# EAGLE design v2.1 USB_UART (EAGLE 9.7.0)
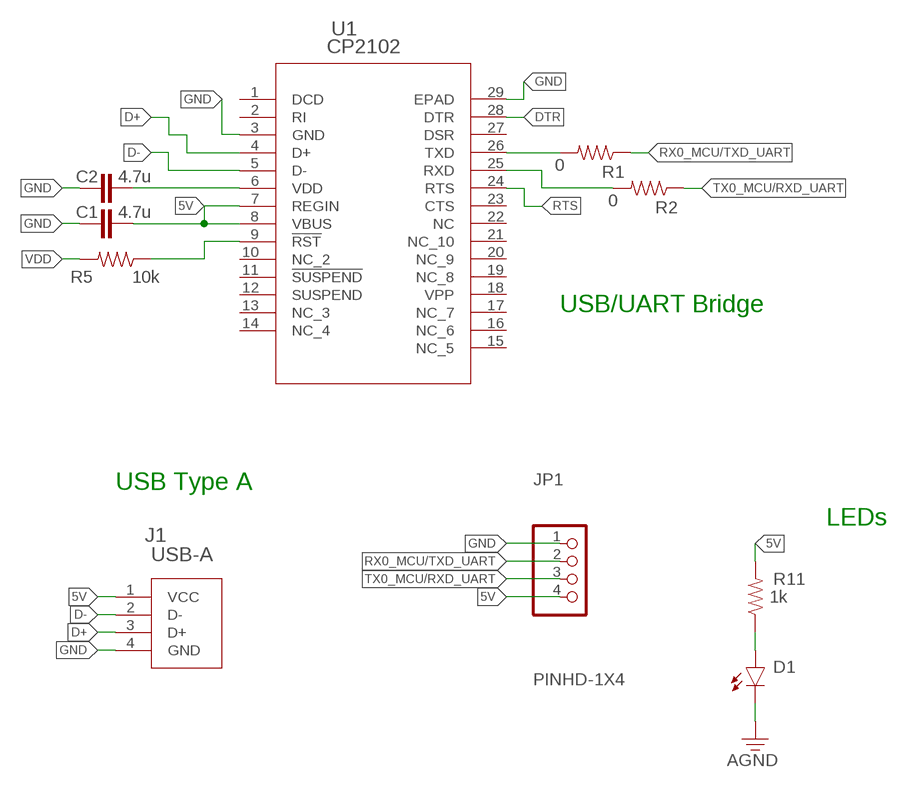
[diagram p0: schematic, sheet 1]

## Parts
C1  4.7u  C_CHIP-0805(2012-METRIC)  [CAPC2012X110]
C2  4.7u  C_CHIP-0805(2012-METRIC)  [CAPC2012X110]
D1  LED  CHIP-FLAT-B_0805  [LEDC2012X110N_FLAT-B]
J1  USB-A  USB-A1VSB6_OST  [USB-A]
JP1  PINHD-1X4  [1X04]
R1  0  R-US_CHIP-0805(2012-METRIC)  [RESC2012X65]
R2  0  R-US_CHIP-0805(2012-METRIC)  [RESC2012X65]
R5  10k  R-US_CHIP-0805(2012-METRIC)  [RESC2012X65]
R11  1k  R-US_CHIP-0805(2012-METRIC)  [RESC2012X65]
U1  CP2102  CP2102-GMQFN28_5X5_SIL  [QFN28_5X5_SIL]

## Nets
5V: C1.2 J1.1(VCC) JP1.4 R11.2 U1.7(REGIN) U1.8(VBUS)
D+: J1.3(D+) U1.4(D+)
D-: J1.2(D-) U1.5(D-)
DTR: U1.28(DTR)
GND: C1.1 C2.1 D1.C J1.4(GND) JP1.1 U1.3(GND) U1.29(EPAD) ; supply symbol labelled AGND
N$1: D1.A R11.1
N$5: R5.1 U1.9(!RST)
RTS: U1.24(RTS)
RX0_MCU/TXD_UART: JP1.2 R1.1
RXD: R2.2 U1.25(RXD)
TX0_MCU/RXD_UART: JP1.3 R2.1
TXD: R1.2 U1.26(TXD)
VDD: C2.2 R5.2 U1.6(VDD)
Unconnected: U1.1(DCD) U1.2(RI) U1.10(NC_2) U1.11(!SUSPEND) U1.12(SUSPEND) U1.13(NC_3) U1.14(NC_4) U1.15(NC_5) U1.16(NC_6) U1.17(NC_7) U1.18(VPP) U1.19(NC_8) U1.20(NC_9) U1.21(NC_10) U1.22(NC) U1.23(CTS) U1.27(DSR)

## Notes on the sheet
- USB/UART Bridge
- USB Type A
- LEDs

## Library data of the parts
C1 C2 = Capacitor:C: Capacitor - Generic; CATEGORY: Capacitor; PACKAGE_SIZE: 0805; PACKAGE_TYPE: SMD; SUBCATEGORY: Ceramic Capacitors; TYPE: MLCC
D1 = LED:CHIP-FLAT-B: Blue LED - Generic; CATEGORY: LED; COLOR: Blue; DESCRIPTION: Blue LED Indication 0805 (2012 Metric); PACKAGE_SIZE: 0805; PACKAGE_TYPE: SMD; SUBCATEGORY: Chip LED; TYPE: Square with Flat Top
J1 = SD-SolderSync-Library:USB-A; COPYRIGHT: Copyright (C) 2025 Ultra Librarian. All rights reserved.; MANUFACTURER_PART_NUMBER: USB-A1VSB6; MFR_NAME: On Shore Technology
JP1 = Connector:PINHD-1X4: PIN HEADER; CATEGORY: Headers; DESCRIPTION: Header-Straight-4 Position; PACKAGE_TYPE: THT; PITCH: 0.100" (2.54mm); SUBCATEGORY: Headers-Male Pins; TYPE: Board to Board or Cable-Unshrouded-Through Hole-Straight
R1 R2 R5 R11 = Resistor:R-US: Resistor Fixed - ANSI; CATEGORY: Resistors; DESCRIPTION: Chip Resistor 2.00 X 1.25 X 0.65 mm body 0805(2012-METRIC) Package; PACKAGE_SIZE: 0805; PACKAGE_TYPE: SMD
U1 = SD-SolderSync-Library:CP2102-GM; COPYRIGHT: Copyright (C) 2025 Ultra Librarian. All rights reserved.; MANUFACTURER_PART_NUMBER: CP2102-GM; MFR_NAME: Silicon Labs

## Board
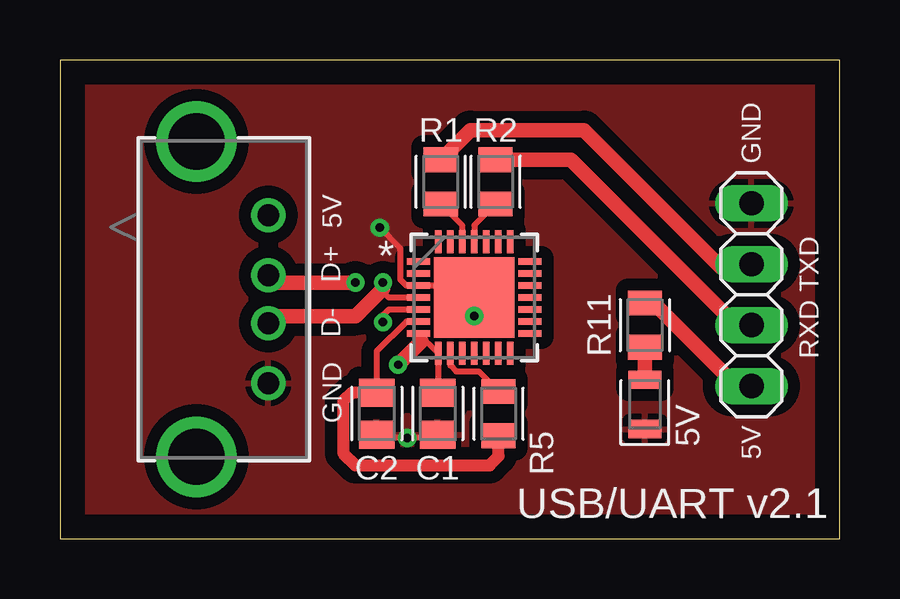
[diagram p1: board, top side]
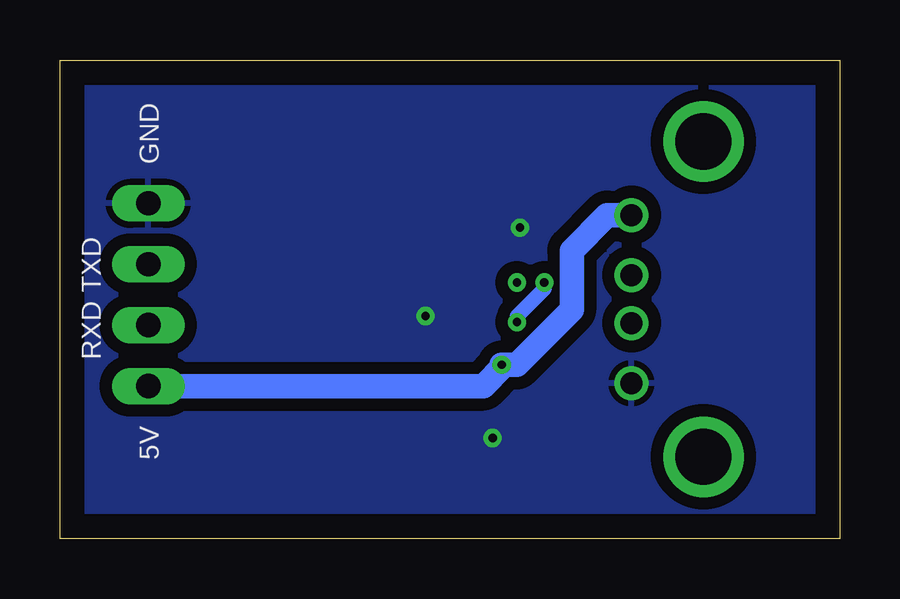
[diagram p2: board, bottom side, seen from below]

Size 32.51 x 19.94 mm. Coordinates in mm from the lower left corner, seen from the top.
Outline: 0,0 32.51,0 32.51,19.94 0,19.94 0,0
Copper layers (1*16): Top 0.035mm / dielectric 1.5mm / Bottom 0.035mm
Design rules "Fusion Electronics Design Rules": minimum track width 6mil, minimum drill 0.35mm, track to track 6mil, track to pad 6mil, pad to pad 6mil, via to via 6mil, smd to smd 6mil, copper to edge 40mil, drill to drill 6mil, minimum pad ring 10mil, minimum via ring 8mil, stop-mask expansion 4mil, vias tented up to drill 0mil, thermal gap 10mil

### Footprints (pad centres in the part's own frame; a part is rotated, then mirrored left to right if it is on the bottom)
CAPC2012X110 = smd 1.165 x 1.465: 1 -0.875,0; 2 0.875,0
LEDC2012X110N_FLAT-B = smd 0.762 x 1.362: A 1.025,0; C -1.025,0
USB-A = drill 0.914 pad 1.422: 1 0,0; 2 2.5,0; 3 4.5,0; 4 7,0 | drill 2.337 pad 2.845: 6 -3.07,-3; 7 10.07,-3
1X04 = drill 1.016 long: 1 -3.81,0; 2 -1.27,0; 3 1.27,0; 4 3.81,0
RESC2012X65 = smd 1.031 x 1.42: 1 -0.919,0; 2 0.919,0
QFN28_5X5_SIL = smd 0.965 x 0.254: 1 -2.324,1.5; 2 -2.324,1; 3 -2.324,0.5; 4 -2.324,0; 5 -2.324,-0.5; 6 -2.324,-1; 7 -2.324,-1.5; 15 2.324,-1.5; 16 2.324,-1; 17 2.324,-0.5; 18 2.324,0; 19 2.324,0.5; 20 2.324,1; 21 2.324,1.5 | smd 0.254 x 0.965: 8 -1.5,-2.324; 9 -1,-2.324; 10 -0.5,-2.324; 11 0,-2.324; 12 0.5,-2.324; 13 1,-2.324; 14 1.5,-2.324; 22 1.5,2.324; 23 1,2.324; 24 0.5,2.324; 25 0,2.324; 26 -0.5,2.324; 27 -1,2.324; 28 -1.5,2.324 | smd 3.353 x 3.353: 29 0,0

### Placement (x,y rotation side)
C1  15.75,5.21 90 top
C2  13.21,5.21 90 top
D1  24.38,5.59 90 top
J1  8.69,13.47 270 top
JP1  28.83,10.16 270 top
R1  15.88,14.86 270 top
R2  18.16,14.86 270 top
R5  18.29,5.21 270 top
R11  24.38,8.89 90 top
U1  17.27,10.04 0 top

### Tracks (layer width: path | path; a pad name or v marks a point on that pad's centre or on a via)
5V  (via drill 0.35)
  Top 0.254: C1.2 15.77,6.11 U1.8 U1.7 15.07,8.41 15.07,8.22
  Top 0.61: v14.1,7.24 15.07,8.22 | JP1.4 28.23,6.35 24.77,9.81 R11.2
  Bottom 1.016: JP1.4 14.86,6.35 14.03,7.18 v14.1,7.24 13.46,7.24 11.18,9.52 11.18,12 9.7,13.47 J1.1
D+  (via drill 0.35)
  Top 0.254: U1.4 13.71,10.04 13.46,10.29 v13.46,10.67
  Top 0.61: J1.3 8.98,9.27 12.32,9.27 13.46,10.41 v13.46,10.67
D-  (via drill 0.35)
  Top 0.254: U1.5 13.7,9.54 13.46,9.3 v13.46,9.02
  Top 0.61: J1.2 8.99,10.67 v12.32,10.67
  Bottom 0.61: v13.46,9.02 13.46,9.27 12.32,10.41 v12.32,10.67
GND  (via drill 0.35)
  Top 0.254: v13.34,12.95 14.19,12.1 14.19,10.8 14.44,10.54 U1.3 15.83,10.54 | C2.1 13.34,4.2 14.46,4.2 v14.48,4.19 15.61,4.19 C1.1
  Top 0.508: U1.29 v17.27,9.27
  Top 0.61: U1.29 16.33,10.04 15.83,10.54
  pour Bottom (isolate 0.508): -1.52,-1.14 33.78,-1.14 33.78,20.83 -1.52,20.83
  pour Top (isolate 0.508): -0.76,-0.76 33.02,-0.76 33.02,20.32 -0.76,20.32
N$1
  Top 0.61: D1.A R11.1
N$5
  Top 0.254: R5.1 17.46,6.96 16.53,6.96 16.27,7.21 U1.9
RX0_MCU/TXD_UART
  Top 0.61: R1.1 17.11,17.02 21.84,17.02 27.56,11.3 28.7,11.3 JP1.2
RXD
  Top 0.254: R2.2 17.27,13.05 U1.25
TX0_MCU/RXD_UART
  Top 0.61: R2.1 21.3,15.78 28.19,8.89 JP1.3
TXD
  Top 0.254: R1.2 16.77,13.04 U1.26
VDD
  Top 0.254: U1.6 14.44,9.04 13.21,7.81 C2.2
  Top 0.508: C2.2 12.18,6.08 11.81,5.72 11.81,3.56 12.32,3.05 17.91,3.05 18.29,3.43 R5.2

### Text on the board
tPlace: GND | 5V | D+ | TXD | D- | GND | RXD | 5V | 5V | USB/UART v2.1
bPlace: GND | TXD | RXD | 5V